# Altium schematic sheet Keyboard_CN.SchDoc
size 594 x 420 mm; SheetNumber: 7; SheetTotal: 8
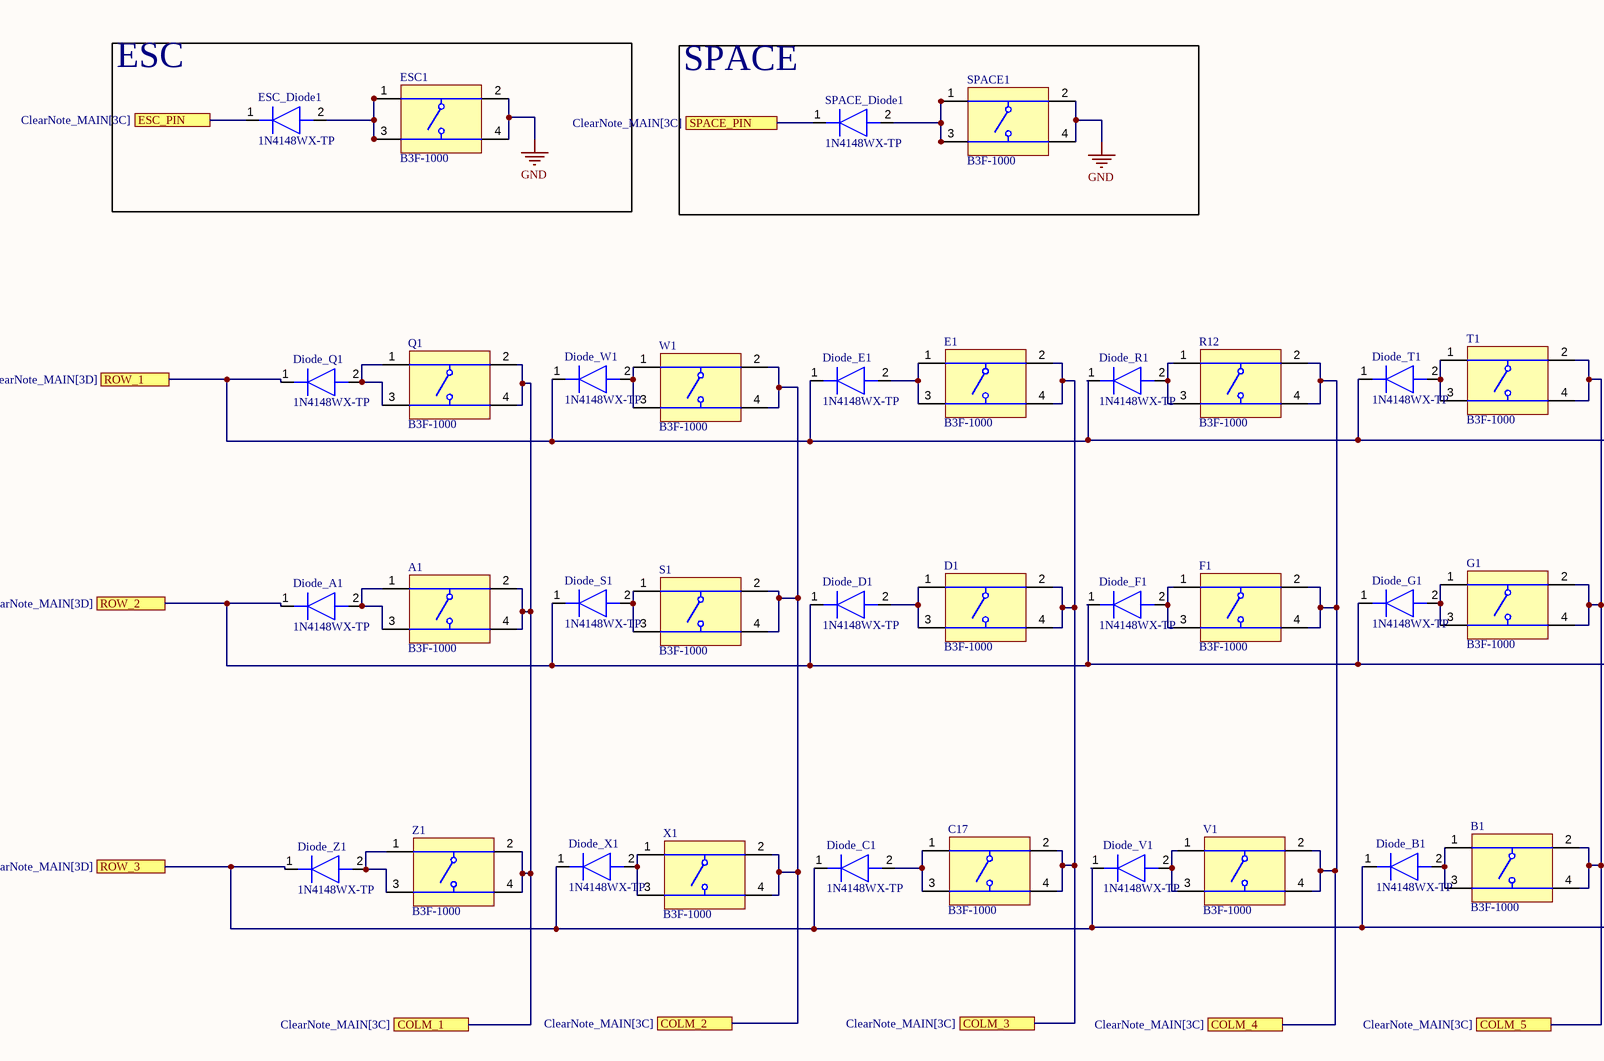
[diagram p0: Keyboard_CN.SchDoc, left]
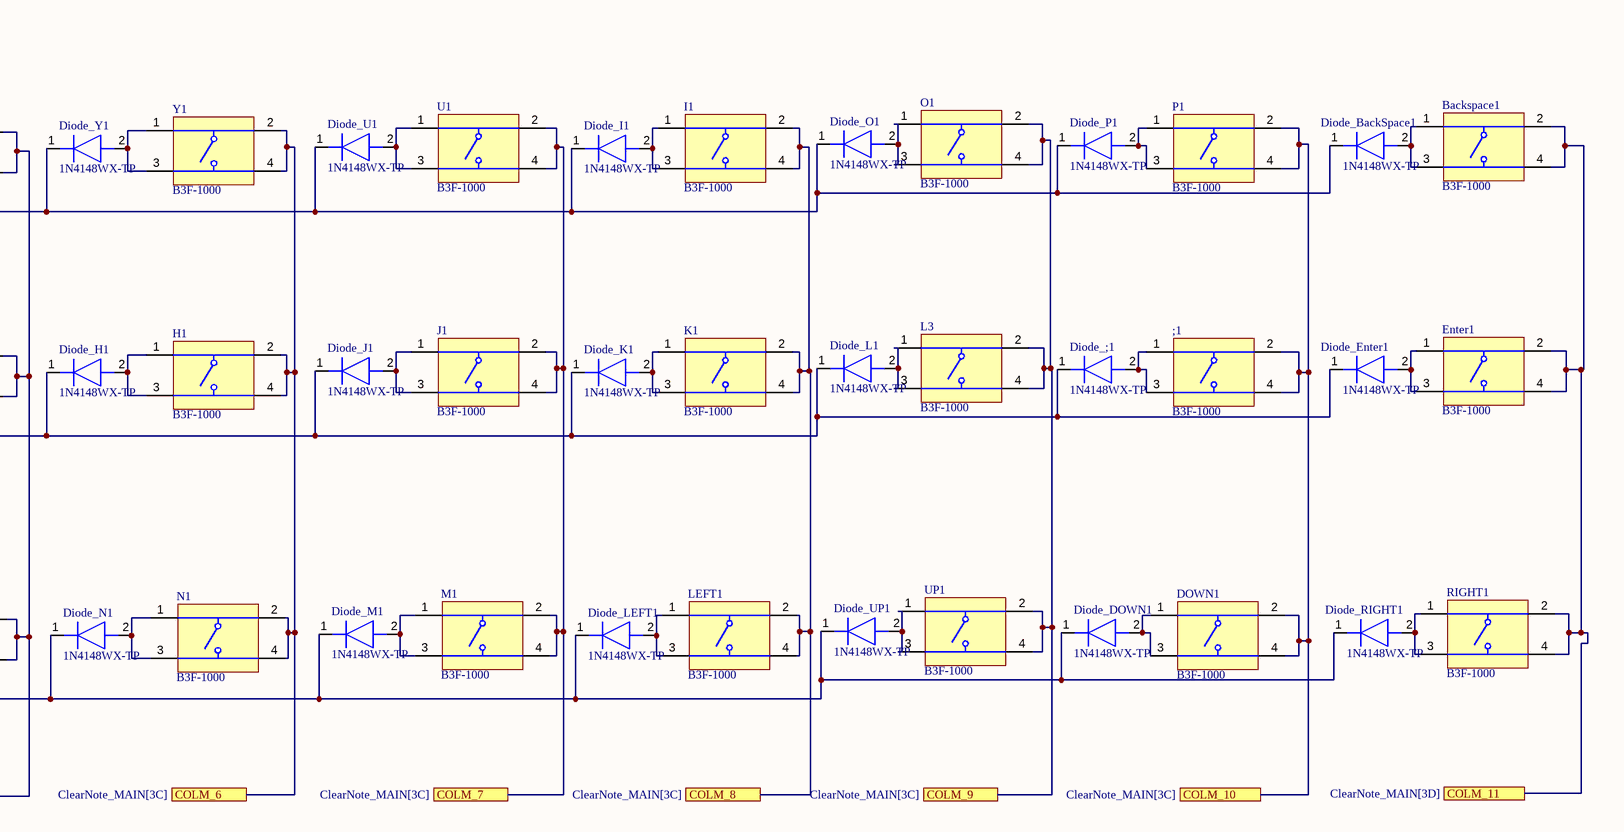
[diagram p1: Keyboard_CN.SchDoc, right]

## Parts
;1  B3F-1000  [OMRON-B3F-1000-4_V]
A1  B3F-1000  [OMRON-B3F-1000-4_V]
B1  B3F-1000  [OMRON-B3F-1000-4_V]
Backspace1  B3F-1000  [OMRON-B3F-1000-4_V]
C17  B3F-1000  [OMRON-B3F-1000-4_V]
D1  B3F-1000  [OMRON-B3F-1000-4_V]
Diode_;1  1N4148WX-TP  [SOD2512X130N]
Diode_A1  1N4148WX-TP  [SOD2512X130N]
Diode_B1  1N4148WX-TP  [SOD2512X130N]
Diode_BackSpace1  1N4148WX-TP  [SOD2512X130N]
Diode_C1  1N4148WX-TP  [SOD2512X130N]
Diode_D1  1N4148WX-TP  [SOD2512X130N]
Diode_DOWN1  1N4148WX-TP  [SOD2512X130N]
Diode_E1  1N4148WX-TP  [SOD2512X130N]
Diode_Enter1  1N4148WX-TP  [SOD2512X130N]
Diode_F1  1N4148WX-TP  [SOD2512X130N]
Diode_G1  1N4148WX-TP  [SOD2512X130N]
Diode_H1  1N4148WX-TP  [SOD2512X130N]
Diode_I1  1N4148WX-TP  [SOD2512X130N]
Diode_J1  1N4148WX-TP  [SOD2512X130N]
Diode_K1  1N4148WX-TP  [SOD2512X130N]
Diode_L1  1N4148WX-TP  [SOD2512X130N]
Diode_LEFT1  1N4148WX-TP  [SOD2512X130N]
Diode_M1  1N4148WX-TP  [SOD2512X130N]
Diode_N1  1N4148WX-TP  [SOD2512X130N]
Diode_O1  1N4148WX-TP  [SOD2512X130N]
Diode_P1  1N4148WX-TP  [SOD2512X130N]
Diode_Q1  1N4148WX-TP  [SOD2512X130N]
Diode_R1  1N4148WX-TP  [SOD2512X130N]
Diode_RIGHT1  1N4148WX-TP  [SOD2512X130N]
Diode_S1  1N4148WX-TP  [SOD2512X130N]
Diode_T1  1N4148WX-TP  [SOD2512X130N]
Diode_U1  1N4148WX-TP  [SOD2512X130N]
Diode_UP1  1N4148WX-TP  [SOD2512X130N]
Diode_V1  1N4148WX-TP  [SOD2512X130N]
Diode_W1  1N4148WX-TP  [SOD2512X130N]
Diode_X1  1N4148WX-TP  [SOD2512X130N]
Diode_Y1  1N4148WX-TP  [SOD2512X130N]
Diode_Z1  1N4148WX-TP  [SOD2512X130N]
DOWN1  B3F-1000  [OMRON-B3F-1000-4_V]
E1  B3F-1000  [OMRON-B3F-1000-4_V]
Enter1  B3F-1000  [OMRON-B3F-1000-4_V]
ESC1  B3F-1000  [OMRON-B3F-1000-4_V]
ESC_Diode1  1N4148WX-TP  [SOD2512X130N]
F1  B3F-1000  [OMRON-B3F-1000-4_V]
G1  B3F-1000  [OMRON-B3F-1000-4_V]
H1  B3F-1000  [OMRON-B3F-1000-4_V]
I1  B3F-1000  [OMRON-B3F-1000-4_V]
J1  B3F-1000  [OMRON-B3F-1000-4_V]
K1  B3F-1000  [OMRON-B3F-1000-4_V]
L3  B3F-1000  [OMRON-B3F-1000-4_V]
LEFT1  B3F-1000  [OMRON-B3F-1000-4_V]
M1  B3F-1000  [OMRON-B3F-1000-4_V]
N1  B3F-1000  [OMRON-B3F-1000-4_V]
O1  B3F-1000  [OMRON-B3F-1000-4_V]
P1  B3F-1000  [OMRON-B3F-1000-4_V]
Q1  B3F-1000  [OMRON-B3F-1000-4_V]
R12  B3F-1000  [OMRON-B3F-1000-4_V]
RIGHT1  B3F-1000  [OMRON-B3F-1000-4_V]
S1  B3F-1000  [OMRON-B3F-1000-4_V]
SPACE1  B3F-1000  [OMRON-B3F-1000-4_V]
SPACE_Diode1  1N4148WX-TP  [SOD2512X130N]
T1  B3F-1000  [OMRON-B3F-1000-4_V]
U1  B3F-1000  [OMRON-B3F-1000-4_V]
UP1  B3F-1000  [OMRON-B3F-1000-4_V]
V1  B3F-1000  [OMRON-B3F-1000-4_V]
W1  B3F-1000  [OMRON-B3F-1000-4_V]
X1  B3F-1000  [OMRON-B3F-1000-4_V]
Y1  B3F-1000  [OMRON-B3F-1000-4_V]
Z1  B3F-1000  [OMRON-B3F-1000-4_V]

## Blocks framed on the sheet
ESC: ESC1 ESC_Diode1
SPACE: SPACE1 SPACE_Diode1

## Ports
COLM_1 (see ClearNote_MAIN[3C]), COLM_2 (see ClearNote_MAIN[3C]), COLM_3 (see ClearNote_MAIN[3C]), COLM_4 (see ClearNote_MAIN[3C]), COLM_5 (see ClearNote_MAIN[3C]), COLM_6 (see ClearNote_MAIN[3C]), COLM_7 (see ClearNote_MAIN[3C]), COLM_8 (see ClearNote_MAIN[3C]), COLM_9 (see ClearNote_MAIN[3C]), COLM_10 (see ClearNote_MAIN[3C]), COLM_11 (see ClearNote_MAIN[3D]), ESC_PIN (see ClearNote_MAIN[3C]), ROW_1 (see ClearNote_MAIN[3D]), ROW_2 (see ClearNote_MAIN[3D]), ROW_3 (see ClearNote_MAIN[3D]), SPACE_PIN (see ClearNote_MAIN[3C])

## Nets
GND: ESC1.2 ESC1.4 SPACE1.2 SPACE1.4
COLM_1: A1.2 A1.4 Q1.2 Q1.4 Z1.2 Z1.4 ; port COLM_1
COLM_2: S1.2 S1.4 W1.2 W1.4 X1.2 X1.4 ; port COLM_2
COLM_3: C17.2 C17.4 D1.2 D1.4 E1.2 E1.4 ; port COLM_3
COLM_4: F1.2 F1.4 R12.2 R12.4 V1.2 V1.4 ; port COLM_4
COLM_5: B1.2 B1.4 G1.2 G1.4 T1.2 T1.4 ; port COLM_5
COLM_6: H1.2 H1.4 N1.2 N1.4 Y1.2 Y1.4 ; port COLM_6
COLM_7: J1.2 J1.4 M1.2 M1.4 U1.2 U1.4 ; port COLM_7
COLM_8: I1.2 I1.4 K1.2 K1.4 LEFT1.2 LEFT1.4 ; port COLM_8
COLM_9: L3.2 L3.4 O1.2 O1.4 UP1.2 UP1.4 ; port COLM_9
COLM_10: ;1.2 ;1.4 DOWN1.2 DOWN1.4 P1.2 P1.4 ; port COLM_10
COLM_11: Backspace1.2 Backspace1.4 Enter1.2 Enter1.4 RIGHT1.2 RIGHT1.4 ; port COLM_11
ESC_PIN: ESC_Diode1.1(K) ; port ESC_PIN
ROW_1: Diode_BackSpace1.1(K) Diode_E1.1(K) Diode_I1.1(K) Diode_O1.1(K) Diode_P1.1(K) Diode_Q1.1(K) Diode_R1.1(K) Diode_T1.1(K) Diode_U1.1(K) Diode_W1.1(K) Diode_Y1.1(K) ; port ROW_1
ROW_2: Diode_;1.1(K) Diode_A1.1(K) Diode_D1.1(K) Diode_Enter1.1(K) Diode_F1.1(K) Diode_G1.1(K) Diode_H1.1(K) Diode_J1.1(K) Diode_K1.1(K) Diode_L1.1(K) Diode_S1.1(K) ; port ROW_2
ROW_3: Diode_B1.1(K) Diode_C1.1(K) Diode_DOWN1.1(K) Diode_LEFT1.1(K) Diode_M1.1(K) Diode_N1.1(K) Diode_RIGHT1.1(K) Diode_UP1.1(K) Diode_V1.1(K) Diode_X1.1(K) Diode_Z1.1(K) ; port ROW_3
SPACE_PIN: SPACE_Diode1.1(K) ; port SPACE_PIN
Net;1_1: ;1.1 ;1.3 Diode_;1.2(A)
NetA1_1: A1.1 A1.3 Diode_A1.2(A)
NetB1_1: B1.1 B1.3 Diode_B1.2(A)
NetBackspace1_1: Backspace1.1 Backspace1.3 Diode_BackSpace1.2(A)
NetC17_1: C17.1 C17.3 Diode_C1.2(A)
NetD1_1: D1.1 D1.3 Diode_D1.2(A)
NetDiode_DOWN1_2: Diode_DOWN1.2(A) DOWN1.1 DOWN1.3
NetDiode_E1_2: Diode_E1.2(A) E1.1 E1.3
NetDiode_Enter1_2: Diode_Enter1.2(A) Enter1.1 Enter1.3
NetDiode_F1_2: Diode_F1.2(A) F1.1 F1.3
NetDiode_G1_2: Diode_G1.2(A) G1.1 G1.3
NetDiode_H1_2: Diode_H1.2(A) H1.1 H1.3
NetDiode_I1_2: Diode_I1.2(A) I1.1 I1.3
NetDiode_J1_2: Diode_J1.2(A) J1.1 J1.3
NetDiode_K1_2: Diode_K1.2(A) K1.1 K1.3
NetDiode_L1_2: Diode_L1.2(A) L3.1 L3.3
NetDiode_LEFT1_2: Diode_LEFT1.2(A) LEFT1.1 LEFT1.3
NetDiode_M1_2: Diode_M1.2(A) M1.1 M1.3
NetDiode_N1_2: Diode_N1.2(A) N1.1 N1.3
NetDiode_O1_2: Diode_O1.2(A) O1.1 O1.3
NetDiode_P1_2: Diode_P1.2(A) P1.1 P1.3
NetDiode_Q1_2: Diode_Q1.2(A) Q1.1 Q1.3
NetDiode_R1_2: Diode_R1.2(A) R12.1 R12.3
NetDiode_RIGHT1_2: Diode_RIGHT1.2(A) RIGHT1.1 RIGHT1.3
NetDiode_S1_2: Diode_S1.2(A) S1.1 S1.3
NetDiode_T1_2: Diode_T1.2(A) T1.1 T1.3
NetDiode_U1_2: Diode_U1.2(A) U1.1 U1.3
NetDiode_UP1_2: Diode_UP1.2(A) UP1.1 UP1.3
NetDiode_V1_2: Diode_V1.2(A) V1.1 V1.3
NetDiode_W1_2: Diode_W1.2(A) W1.1 W1.3
NetDiode_X1_2: Diode_X1.2(A) X1.1 X1.3
NetDiode_Y1_2: Diode_Y1.2(A) Y1.1 Y1.3
NetDiode_Z1_2: Diode_Z1.2(A) Z1.1 Z1.3
NetESC1_1: ESC1.1 ESC1.3 ESC_Diode1.2(A)
NetSPACE1_1: SPACE1.1 SPACE1.3 SPACE_Diode1.2(A)

## Notes on the sheet
- DWG NO:
- REV:
- THIS DOCUMENT AND THE DATA DISCLOSED HEREIN OR
- HEREWITH IS THE PROPERTY OF ALTIUM LIMITED AND MAY
- BE FREELY DISTRIBUTED IN WHOLE. NO RIGHTS ARE
- RESERVED OR EXPRESS OR IMPLIED WARANTEE GIVEN.
- REVISION
- DESCRIPTION
- DATE
- APPROVED
- ENG:
- APPROVALS
- PROJECT
- DSN:
- CHK:
- REFERENCE DOCUMENTS
- PROJECT REVISION:
- TITLE
- DOCUMENT REVISION:
- DESIGN ITEM:
- BOM:
- FAB DWG:
- PCB DWG:
- ASSY DWG:
- SCALE:
- A2
- SIZE
- CAGE CODE
- FILE NAME
- DWG NO.
- SHEET
- OF
- REV

## Library data of the parts
;1 A1 B1 Backspace1 C17 D1 DOWN1 E1 Enter1 ESC1 F1 G1 H1 I1 J1 K1 L3 LEFT1 M1 N1 O1 P1 Q1 R12 RIGHT1 S1 SPACE1 T1 U1 UP1 V1 W1 X1 Y1 Z1 = CMP-011-00004-2: Tactile Switch, SPST-NO, 0.05 A, 24 V, -25 to 70 degC, 4-Pin THD, RoHS, Bulk; Manufacturer: Omron Electronic Components; Throw Configuration: SPST; Max Contact Resistance: 100mohm; Resistance: 0.1Ohm; Max Current Rating: 50mA; Voltage Rating: 24V; Operating Force: 100gf; Datasheet Version: Jan-15; Case/Package: B3F-1000; Packaging: Bulk; Package Description: 4-Pin Through Hole Device, Body 6 x 6 mm; Manufacturer URL: http://www.omron.com/; Package Reference: B3F-1000; Contact Plating: Gold; Contact Current Rating: 50mA; RoHS Compliant: True; Contact Material: Gold; Mounting Technology: TH; Max Operating Temperature: 70°C; Min Operating Temperature: -25°C; Package Quantity: 1500; Datasheet URL: http://www.omron.com/ecb/products/pdf/en-b3f.pdf; Voltage Rating (DC): 24V; Pins: 4; Current Rating: 50mA; Max Voltage Rating (DC): 24V
Diode_;1 Diode_A1 Diode_B1 Diode_BackSpace1 Diode_C1 Diode_D1 Diode_DOWN1 Diode_E1 Diode_Enter1 Diode_F1 Diode_G1 Diode_H1 Diode_I1 Diode_J1 Diode_K1 Diode_L1 Diode_LEFT1 Diode_M1 Diode_N1 Diode_O1 Diode_P1 Diode_Q1 Diode_R1 Diode_RIGHT1 Diode_S1 Diode_T1 Diode_U1 Diode_UP1 Diode_V1 Diode_W1 Diode_X1 Diode_Y1 Diode_Z1 ESC_Diode1 SPACE_Diode1 = 1N4148WX-TP: Diode; Manufacturer_Name: Vishay; Datasheet Link: https://www.mouser.co.uk/datasheet/2/258/1N4148WX_SOD_323_-3326905.pdf; Height: 1.3mm; Manufacturer_Part_Number: 1N4148WX-TP